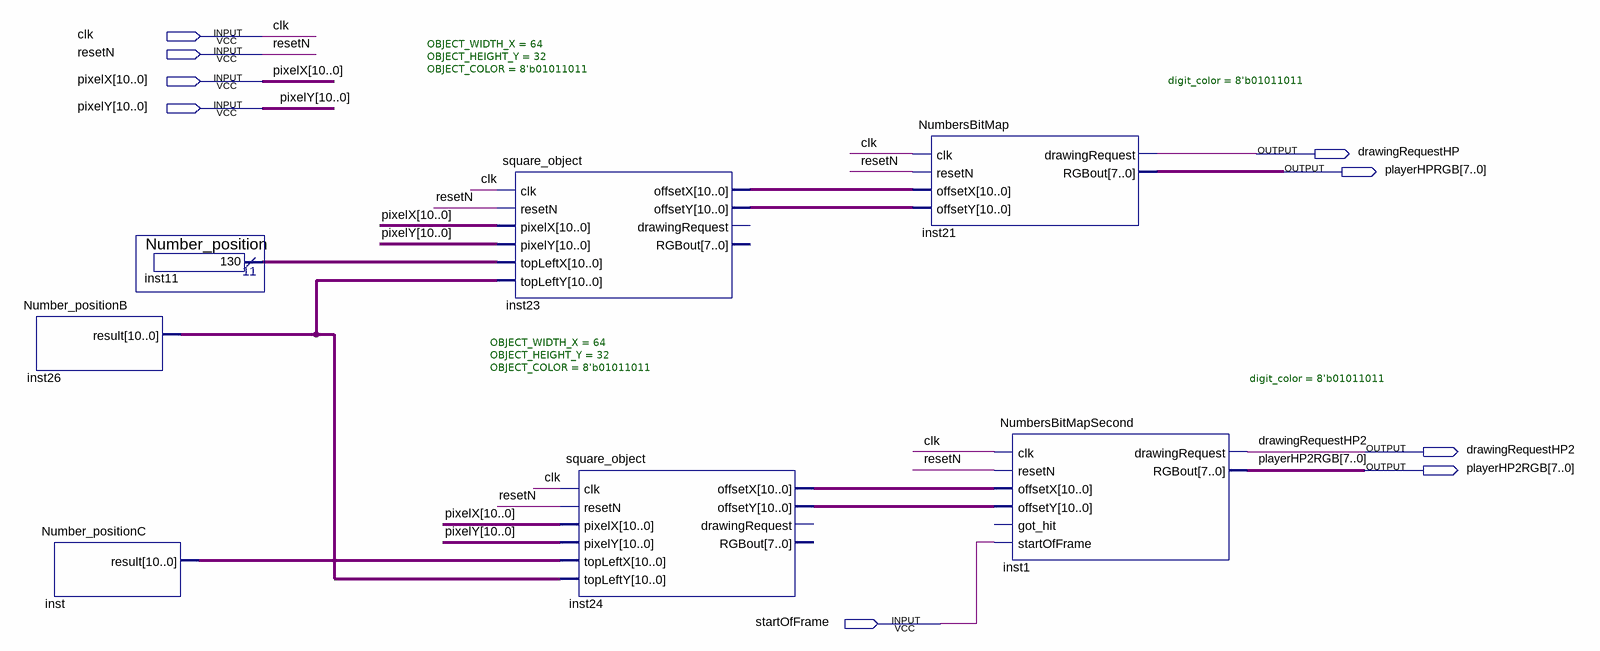
[diagram p0: schematic sheet]
// Quartus schematic SCORE_DISPLAY.bdf as structural Verilog: 7 symbols, 9 pins
module SCORE_DISPLAY (
  input  clk,
  input  resetN,
  input  [10:0] pixelX,
  input  [10:0] pixelY,
  input  startOfFrame,
  output drawingRequestHP,
  output [7:0] playerHPRGB,
  output drawingRequestHP2,
  output [7:0] playerHP2RGB
);

  wire [10:0] inst11_result, inst23_offsetx, inst23_offsety, inst24_offsetx, inst24_offsety, inst26_result,
       inst_result;

  Number_positionB inst26 (.result(inst26_result));
  Number_positionC inst (.result(inst_result));
  Number_position inst11 (.result(inst11_result));
  square_object #(.OBJECT_WIDTH_X(64), .OBJECT_HEIGHT_Y(32), .OBJECT_COLOR(8'b01011011)) inst23 (
    .clk(clk), .resetN(resetN), .pixelX(pixelX), .pixelY(pixelY), .topLeftX(inst11_result),
    .topLeftY(inst26_result), .offsetX(inst23_offsetx), .offsetY(inst23_offsety));  // open: drawingRequest, RGBout
  square_object #(.OBJECT_WIDTH_X(64), .OBJECT_HEIGHT_Y(32), .OBJECT_COLOR(8'b01011011)) inst24 (
    .clk(clk), .resetN(resetN), .pixelX(pixelX), .pixelY(pixelY), .topLeftX(inst_result),
    .topLeftY(inst26_result), .offsetX(inst24_offsetx), .offsetY(inst24_offsety));  // open: drawingRequest, RGBout
  NumbersBitMap #(.digit_color(8'b01011011)) inst21 (
    .clk(clk), .resetN(resetN), .offsetX(inst23_offsetx), .offsetY(inst23_offsety),
    .drawingRequest(drawingRequestHP), .RGBout(playerHPRGB));
  NumbersBitMapSecond #(.digit_color(8'b01011011)) inst1 (
    .clk(clk), .resetN(resetN), .offsetX(inst24_offsetx), .offsetY(inst24_offsety),
    .startOfFrame(startOfFrame), .drawingRequest(drawingRequestHP2), .RGBout(playerHP2RGB));  // open: got_hit
endmodule
